# Altium schematic sheet 05_Wireless.SchDoc
size A4
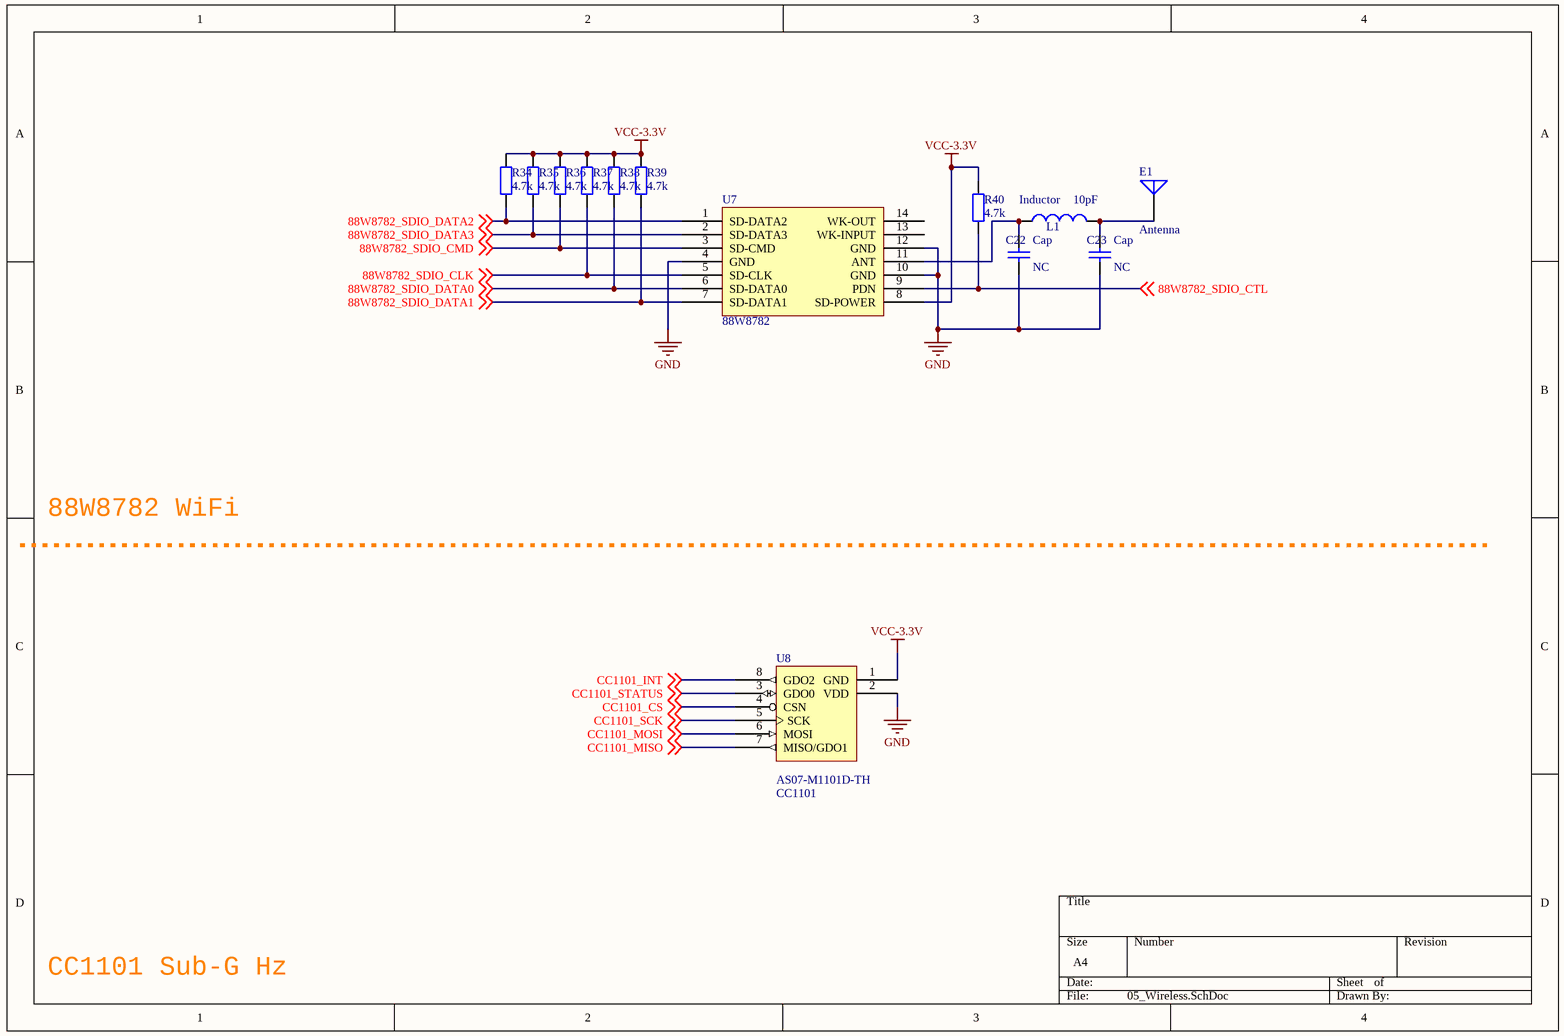
[diagram p0: 05_Wireless.SchDoc]

## Parts
C22  Cap  value NC  [RAD-0.1]
C23  Cap  value NC  [RAD-0.1]
E1  Antenna  [ANT_MEANDER_LINE]
L1  Inductor  value 10pF  [0603]
R34  value 4.7k  [AXIAL-0.3]  (hidden comment: 10k)
R35  value 4.7k  [AXIAL-0.3]  (hidden comment: 10k)
R36  value 4.7k  [AXIAL-0.3]  (hidden comment: 10k)
R37  value 4.7k  [AXIAL-0.3]  (hidden comment: 10k)
R38  value 4.7k  [AXIAL-0.3]  (hidden comment: 10k)
R39  value 4.7k  [AXIAL-0.3]  (hidden comment: 10k)
R40  value 4.7k  [AXIAL-0.3]  (hidden comment: 10k)
U7  88W8782  [W8782]
U8  CC1101  [AS07-M1101D-TH]

## Nets
GND: C22.1 C23.1 U7.4(GND) U7.10(GND) U7.12(GND) U8.2(VDD)
VCC-3.3V: R34.2 R35.2 R36.2 R37.2 R38.2 R39.2 R40.2 U7.8(SD-POWER) U8.1(GND)
88W8782_SDIO_CLK: R37.1 U7.5(SD-CLK) ; off-sheet 88W8782_SDIO_CLK
88W8782_SDIO_CMD: R36.1 U7.3(SD-CMD) ; off-sheet 88W8782_SDIO_CMD
88W8782_SDIO_CTL: R40.1 U7.9(PDN) ; off-sheet 88W8782_SDIO_CTL
88W8782_SDIO_DATA0: R38.1 U7.6(SD-DATA0) ; off-sheet 88W8782_SDIO_DATA0
88W8782_SDIO_DATA1: R39.1 U7.7(SD-DATA1) ; off-sheet 88W8782_SDIO_DATA1
88W8782_SDIO_DATA2: R34.1 U7.1(SD-DATA2) ; off-sheet 88W8782_SDIO_DATA2
88W8782_SDIO_DATA3: R35.1 U7.2(SD-DATA3) ; off-sheet 88W8782_SDIO_DATA3
CC1101_CS: U8.4(CSN) ; off-sheet CC1101_CS
CC1101_INT: U8.8(GDO2) ; off-sheet CC1101_INT
CC1101_MISO: U8.7(MISO/GDO1) ; off-sheet CC1101_MISO
CC1101_MOSI: U8.6(MOSI) ; off-sheet CC1101_MOSI
CC1101_SCK: U8.5(SCK) ; off-sheet CC1101_SCK
CC1101_STATUS: U8.3(GDO0) ; off-sheet CC1101_STATUS
NetC22_2: C22.2 L1.1 U7.11(ANT)
NetC23_2: C23.2 E1.1(A) L1.2

Not connected (* = marked no-connect by the designer): U7 13(WK-INPUT) 14(WK-OUT)

## Notes on the sheet
- 88W8782 WiFi Module
- CC1101 Sub-G Hz Module
- (in symbol CC1101) AS07-M1101D-TH

## Library data of the parts
C22 C23 = Cap: Capacitor; Published: 8-Jun-2000; LatestRevisionDate: 17-Jul-2002; LatestRevisionNote: Re-released for DXP Platform.; PackageReference: RAD-0.3; Publisher: Altium Limited; PackageDescription: Radial Cap, Thru-Hole; 2 Leads; 0.3 in Pin Spacing
E1 = Antenna: Generic Antenna; Published: 24-Mar-1999; LatestRevisionDate: 17-Jul-2002; LatestRevisionNote: Re-released for DXP Platform.; PackageReference: PIN1; Publisher: Altium Limited
L1 = Inductor: Code_IEC: 1005; Published: 8-Jun-2000; LatestRevisionDate: 29-May-2009; LatestRevisionNote: IPC-7351 Footprint Added.; PackageReference: 0402-A; Publisher: Altium Limited; PackageDescription: Chip Inductor; Code_JEITA: 0402
R34-R40 = Res1: 贴片电阻; Published: 8-Jun-2000; LatestRevisionDate: 17-Jul-2002; LatestRevisionNote: Re-released for DXP Platform.; PackageReference: AXIAL-0.4; Publisher: Altium Limited
U7 = 88W8782: 802.11n Wireless Module
U8 = CC1101: Manufacturer: Texas Instruments (TI); Manufacturer Part Number: CC1101RGP; Frequency Range: 300 MHz to 348 MHz, 391 MHz to 464 MHz, 782 MHz to 928 MHz; Maximum Data Rate: 500 kb/s; Modulation Format: 2-FSK, 4-FSK, ASK, GFSK, MSK, OOK; Output Power: 12 dBm; Operating Supply Voltage: 1.8 V to 3.6 V; Interface Type: SPI; Brand: Texas Instruments; Number of Receivers: 1; Sensitivity: - 116 dBm; Supply Current Receiving: 14 mA; Supply Voltage - Max: 3.6 V; Supply Voltage - Min: 1.8 V; Supplier 1: Digikey; Stock 1: 0; Pricing 1: 184=4.059 (USD); Product Category: RF Transceiver; RoHS: Details; Type: Wi-Fi; Maximum Operating Temperature: + 85 C; Package / Case: VQFN-20; Packaging: Tube; Minimum Operating Temperature: - 40 C; Mounting Style: SMD/SMT; Number of Transmitters: 1; Series: CC1101; Factory Pack Quantity: 92; ComponentLink1URL: https://datasheet.ciiva.com/23815/1719597-23815626.pdf; ComponentLink1Description: https://datasheet.ciiva.com/23815/1719597-23815626.pdf; ComponentLink2URL: https://datasheet.ciiva.com/15309/swrs061i-317099-15309888.pdf; ComponentLink2Description: https://datasheet.ciiva.com/15309/swrs061i-317099-15309888.pdf; ComponentLink3URL: https://datasheet.ciiva.com/26913/getdatasheetpartid-739309-26913178.pdf; ComponentLink3Description: https://datasheet.ciiva.com/26913/getdatasheetpartid-739309-26913178.pdf; Supplier Part Number 1: CC1101RGP-ND; Order Link: https://item.taobao.com/item.htm?spm=a1z09.2.0.0.0HJvpv&id=36617396595&_u=88jolfh2abc